# Altium schematic sheet 02-RaspberryPi_Header.SchDoc
size A; DocumentNumber: 2; SheetNumber: 2; SheetTotal: 4
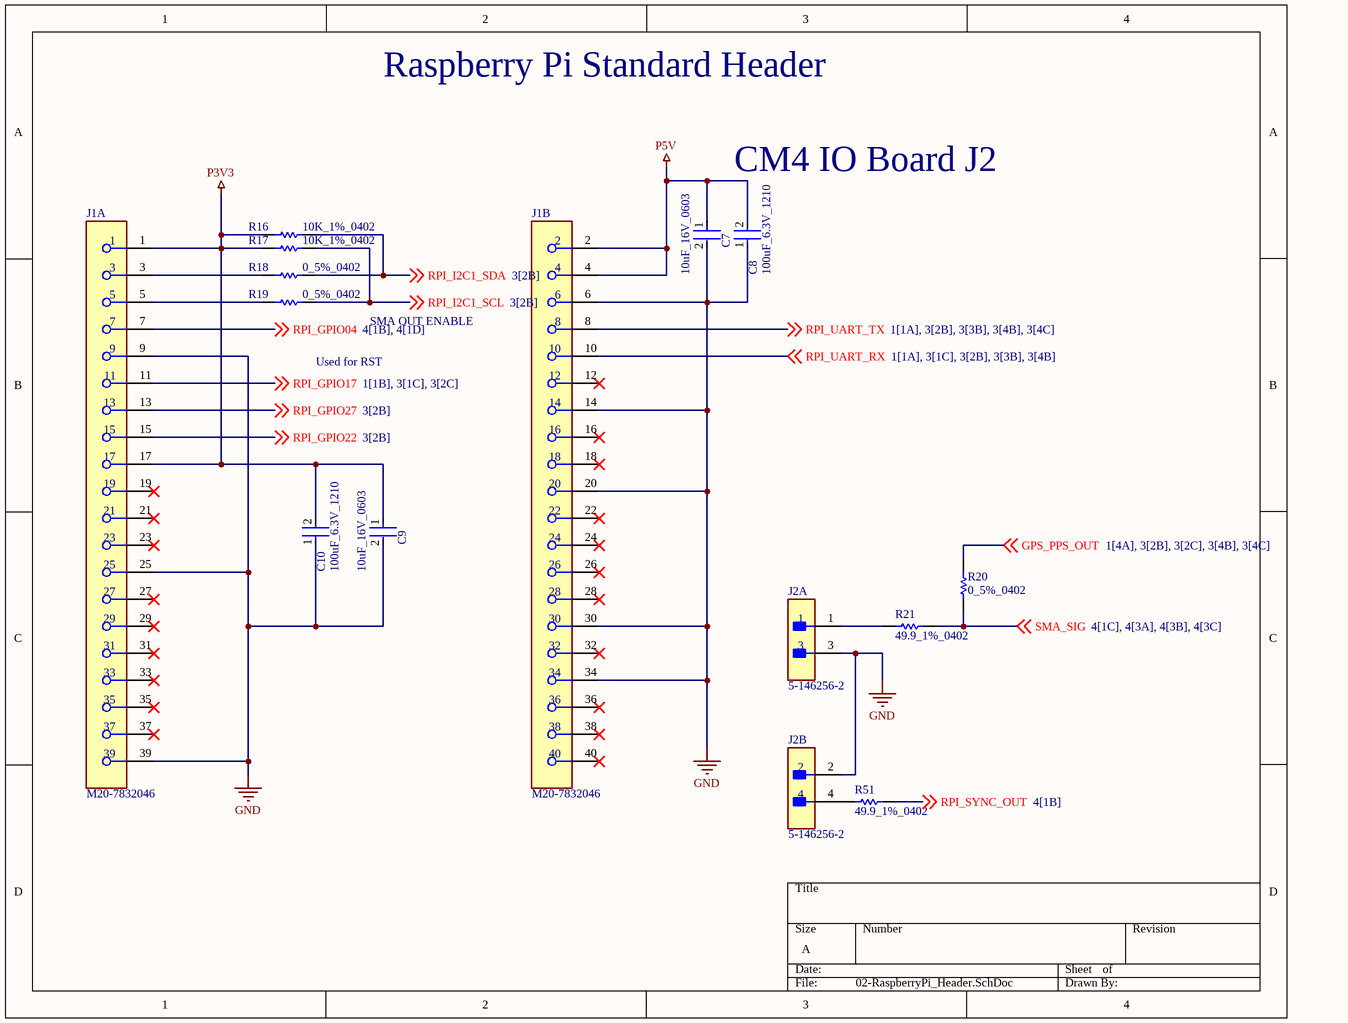
[diagram p0: 02-RaspberryPi_Header.SchDoc]

## Parts
C7  10uF_16V_0603  [FP-0603-L_1_6_0_2-W_0_8_0-MFG]
C8  100uF_6.3V_1210  [FP-C1210C107M9PACTU-MFG]
C9  10uF_16V_0603  [FP-0603-L_1_6_0_2-W_0_8_0-MFG]
C10  100uF_6.3V_1210  [FP-C1210C107M9PACTU-MFG]
J1  M20-7832046  [FP-M20-7832046-MFG]  (parts A,B of 2)
J2  5-146256-2  [FP-5-146256-2-MFG]  (parts A,B of 2)
R16  10K_1%_0402  [RESC1005X40X25LL05T05]
R17  10K_1%_0402  [RESC1005X40X25LL05T05]
R18  0_5%_0402  [RESC1005X40X25NL05T10]
R19  0_5%_0402  [RESC1005X40X25NL05T10]
R20  0_5%_0402  [RESC1005X40X25NL05T10]
R21  49.9_1%_0402  [RESC1005X40X25LL05T05]
R51  49.9_1%_0402  [RESC1005X40X25LL05T05]

## Nets
GND: C7.2 C8.1 C9.2 C10.1 J1.6 J1.9 J1.14 J1.20 J1.25 J1.30 J1.34 J1.39 J2.2 J2.3
P3V3: C9.1 C10.2 J1.1 J1.17 R16.1 R17.1
P5V: C7.1 C8.2 J1.2 J1.4
GPS_PPS_OUT: R20.1 ; off-sheet GPS_PPS_OUT
RPI_GPIO04: J1.7 ; off-sheet RPI_GPIO04
RPI_GPIO17: J1.11 ; off-sheet RPI_GPIO17
RPI_GPIO22: J1.15 ; off-sheet RPI_GPIO22
RPI_GPIO27: J1.13 ; off-sheet RPI_GPIO27
RPI_I2C1_SCL: R17.2 R19.2 ; off-sheet RPI_I2C1_SCL
RPI_I2C1_SDA: R16.2 R18.2 ; off-sheet RPI_I2C1_SDA
RPI_SYNC_OUT: R51.2 ; off-sheet RPI_SYNC_OUT
RPI_UART_RX: J1.10 ; off-sheet RPI_UART_RX
RPI_UART_TX: J1.8 ; off-sheet RPI_UART_TX
SMA_SIG: R20.2 R21.2 ; off-sheet SMA_SIG
NetJ1_3: J1.3 R18.1
NetJ1_5: J1.5 R19.1
NetJ2_1: J2.1 R21.1
NetJ2_4: J2.4 R51.1

Not connected (* = marked no-connect by the designer): J1 12* 16* 18* 19* 21* 22* 23* 24* 26* 27* 28* 29* 31* 32* 33* 35* 36* 37* 38* 40*

## Notes on the sheet
- Raspberry Pi Standard Header
- CM4 IO Board J2
- Used for RST
- SMA OUT ENABLE

## Library data of the parts
C7 C9 = CMP-2000-06226-4: Multilayer Ceramic Capacitor 10uF 16V X5R 20% SMD 0603 T/R; Packaging: Tape and Reel; Construction: Flat; Height: 0.8mm; Max Operating Temperature: 85°C; Dielectric: X5R; Case Code (Metric): 1608; Voltage Rating (DC): 16V; Width: 0.031inch; Voltage Rating: 16V; Length: 0.063inch; RoHS Compliant: Yes; Halogen Free: Halogen Free; Case Code (Imperial): 0603; Capacitance: 10uF; Mount: Surface Mount; Thickness: 0.031inch; Tolerance: 20%; Min Operating Temperature: -55°C; Series: M; Termination: SMD/SMT; Case/Package: 0603; Package Quantity: 1
C8 C10 = CMP-2000-06018-2: CAP CER 100UF 6.3V X5R 1210; Dissipation Factor: 5%; Dielectric Material: Ceramic; Tolerance: 20%; Termination: SMD/SMT; REACH SVHC: No SVHC; Thickness: 0.11inch; Packaging: Tape and Reel; Series: C; Width: 2.5mm; Voltage Rating (DC): 6.3V; Voltage: 6.3V; Contact Plating: Tin; Package Quantity: 1; Case/Package: 1210; Min Operating Temperature: -55°C; Height: 2.5mm; Radiation Hardening: No; Capacitance: 100uF; Case Code (Metric): 3225; Depth: 2.5mm; Construction: Flat; Max Operating Temperature: 85°C; Number of Pins: 2; Mount: Surface Mount; Lead Free: Lead Free; RoHS Compliant: Yes; Voltage Rating: 6.3V; Dielectric: X5R; Length: 3.2mm; Case Code (Imperial): 1210
J1 = CMP-15831-000036-1: CONN RCPT 40POS 0.1 TIN PCB; Connector Type: Receptacle; Contact Resistance: 20mR; Pitch: 2.54mm; Insulation Resistance: 1MR; Mating Cycles: 50; Number of Contacts: 40; Max Current Rating: 3A; Hole Diameter: 0.8mm; Row Spacing: 0.1inch; Contact Material: Bronze; RoHS Compliant: Yes; Min Operating Temperature: -40°C; Mount: Through Hole; Gender: Receptacle; Depth: 5.04mm; Package Quantity: 11; Series: M20; REACH SVHC: No SVHC; Color: Black; Lead Pitch: 2.54mm; Max Operating Temperature: 105°C; Orientation: Straight; Radiation Hardening: No; Contact Plating: Tin; Housing Material: Polyamide; Housing Color: Black; Length: 51.2mm; Contact Gender: Female; Number of Positions: 40; Packaging: Rail/Tube; Number of Rows: 2; Material: Glass; Contact Type: Female Socket; Current Rating: 3A; Termination: Solder
J2 = CMP-03369-000128-1: CONN HEADER VERT 4POS 2.54MM; Connector Type: Plug; Number of Positions: 4; High Speed Serial Data Connector: No; High Temperature Housing: Yes; Strain Relief: No (Without); Contact Current Rating: 3A; Board Standoff: Yes (With); PCB Mounting Orientation: Vertical; PCB Mount Retention: Without; Contact Post Length: 0.12inch; PCB Thickness: 0.062inch; Approvals: CSA; Voltage Rating: 750V; Insulation Resistance: 5GR; Radiation Hardening: No; Packaging: Carton; Housing Color: Black; Contact Material: Bronze; Depth: 4.88mm; Row Spacing: 2.54mm; Number of Contacts: 4; Contact Shape: Square; Contact Type: Male Pin; Min Operating Temperature: -65°C; Pitch: 2.54mm; Flammability Rating: UL94 V-0; Keyed: No; Housing Material: Thermoplastic; Mount: Through Hole; Length: 4.67mm; Mating Connector Lock: No (Without); Selectively Loaded: No (Without); Contact Mating Length: 0.23inch; Contact Protection: No (Without); Contact Gender: Male; Current Rating: 3A; Number of Rows: 2; Termination: Through Hole; Color: Black; RoHS Compliant: Yes; Gasket: No (Without); Contact Plating: Gold; Max Operating Temperature: 105°C; Mating Alignment: No (Without); Series: AMPMODU MOD II; Orientation: Straight; Package Quantity: 500; Stabilizers: No (Without)
R16 R17 = CMP-2000-07588-1: Chip Resistor, 10 KOhm, +/- 1%, 0.1 W, -55 to 155 degC, 0402 (1005 Metric), RoHS, Tape and Reel; Manufacturer: Panasonic; Power Rating: 100mW; Voltage Rating: 50V; Resistance: 10KOhm; Case\/Package: 0402; Temperature Coefficient: 100ppm\/degreesC; RoHSCompliant: True; Lead Free: LeadFree; Package Quantity: 1; Contact Plating: Tin; Length: 1mm; Radiation Hardening: No; REACH SVHC: NoSVHC; Max Operating Temperature: 155degC; Depth: 0.5mm; Case Code (Imperial): 0402; Military Standard: Not; Package Description: 2-Pin Surface Mount Device, Body 1 x 0.5 mm; Termination: SMD/SMT; Case Code (Metric): 1005; Height: 0.35mm; Packaging: TapeandReel; Voltage Rating (DC): 50V; Package Reference: 402; Number of Pins: 2; Tolerance: 1%; Mounting Technology: SurfaceMount; Width: 0.02inch; Mount: SurfaceMount; Datasheet URL: https://industrial.panasonic.com/cdbs/www-data/pdf/RDA0000/AOA0000C304.pdf; Composition: ThickFilm; Datasheet Version: 02/2017; Manufacturer URL: http://www.panasonic.com/; Max Power Dissipation: 100mW; Number of Terminations: 2; Min Operating Temperature: -55degC
R18-R20 = CMP-1011-00001-2: Manufacturer: Yageo / Phycomp; Part Number: RC0402JR-070RL
R21 R51 = CMP-2002-00039-1: Part Number: CRCW040249K9FKED; Manufacturer: Vishay Dale